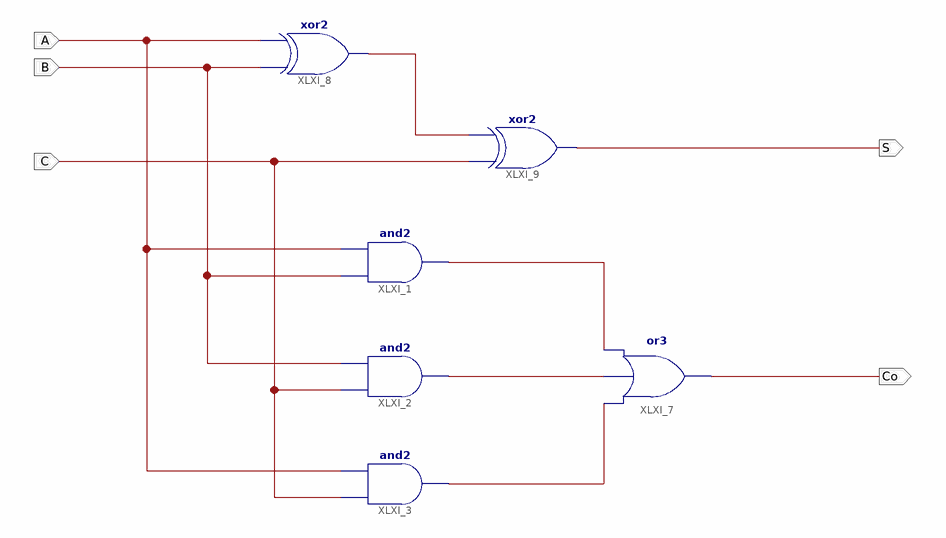
[diagram p0: schematic sheet 1]
// Xilinx ISE schematic Adder1b_sch.sch (kintex7) as structural Verilog: 6 symbols, 5 ports
module Adder1b_sch (
  input  A,
  input  B,
  input  C,
  output S,
  output Co
);

  wire XLXN_4, XLXN_8, XLXN_9, XLXN_10;

  and XLXI_1 (XLXN_8, B, A);
  and XLXI_2 (XLXN_9, C, B);
  and XLXI_3 (XLXN_10, C, A);
  or XLXI_7 (Co, XLXN_10, XLXN_9, XLXN_8);
  xor XLXI_8 (XLXN_4, B, A);
  xor XLXI_9 (S, C, XLXN_4);
endmodule
